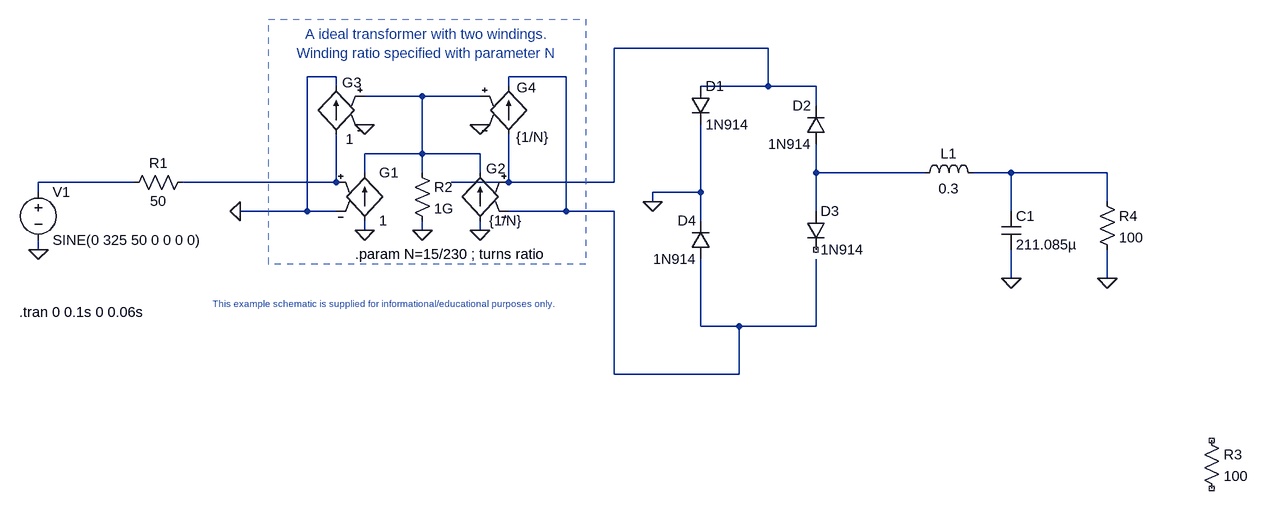
[diagram p0: schematic LC_filter2_withRectifier.asc]
LC_filter2_withRectifier.asc, the LTspice schematic file:
Version 4
SHEET 1 1204 680
WIRE -6096 -2176 -6352 -2176
WIRE -6816 -2128 -6864 -2128
WIRE -6432 -2128 -6528 -2128
WIRE -6816 -2112 -6816 -2128
WIRE -6528 -2112 -6528 -2128
WIRE -6096 -2112 -6096 -2176
WIRE -6096 -2112 -6208 -2112
WIRE -6016 -2112 -6096 -2112
WIRE -6672 -2096 -6768 -2096
WIRE -6576 -2096 -6672 -2096
WIRE -6016 -2080 -6016 -2112
WIRE -6672 -2000 -6672 -2096
WIRE -6672 -2000 -6768 -2000
WIRE -6576 -2000 -6672 -2000
WIRE -6768 -1968 -6768 -2000
WIRE -6672 -1968 -6672 -2000
WIRE -6576 -1968 -6576 -2000
WIRE -6016 -1968 -6016 -2016
WIRE -5616 -1968 -6016 -1968
WIRE -5472 -1968 -5536 -1968
WIRE -5312 -1968 -5472 -1968
WIRE -7152 -1952 -7312 -1952
WIRE -6816 -1952 -6816 -2032
WIRE -6816 -1952 -7072 -1952
WIRE -6528 -1952 -6528 -2032
WIRE -6528 -1952 -6624 -1952
WIRE -6352 -1952 -6352 -2176
WIRE -6352 -1952 -6528 -1952
WIRE -7312 -1936 -7312 -1952
WIRE -6208 -1936 -6208 -2048
WIRE -6208 -1936 -6288 -1936
WIRE -6288 -1920 -6288 -1936
WIRE -5312 -1920 -5312 -1968
WIRE -6864 -1904 -6864 -2128
WIRE -6864 -1904 -6976 -1904
WIRE -6816 -1904 -6864 -1904
WIRE -6432 -1904 -6432 -2128
WIRE -6432 -1904 -6528 -1904
WIRE -6352 -1904 -6432 -1904
WIRE -6016 -1904 -6016 -1968
WIRE -5472 -1904 -5472 -1968
WIRE -6208 -1888 -6208 -1936
WIRE -6768 -1872 -6768 -1888
WIRE -6672 -1872 -6672 -1888
WIRE -6576 -1872 -6576 -1888
WIRE -7312 -1840 -7312 -1856
WIRE -5472 -1792 -5472 -1840
WIRE -5312 -1792 -5312 -1840
WIRE -6208 -1712 -6208 -1824
WIRE -6144 -1712 -6208 -1712
WIRE -6016 -1712 -6016 -1824
WIRE -6016 -1712 -6144 -1712
WIRE -6352 -1632 -6352 -1904
WIRE -6144 -1632 -6144 -1712
WIRE -6144 -1632 -6352 -1632
FLAG -7312 -1840 0
FLAG -6576 -1872 0
FLAG -6768 -1872 0
FLAG -6768 -2048 0
FLAG -6576 -2048 0
FLAG -6672 -1872 0
FLAG -6976 -1904 0
FLAG -6288 -1920 0
FLAG -5472 -1792 0
FLAG -5312 -1792 0
SYMBOL voltage -7312 -1952 R0
WINDOW 123 0 0 Left 0
WINDOW 39 0 0 Left 0
SYMATTR InstName V1
SYMATTR Value SINE(0 325 50 0 0 0 0)
SYMBOL res -7056 -1968 R90
WINDOW 0 0 56 VBottom 2
WINDOW 3 32 56 VTop 2
SYMATTR InstName R1
SYMATTR Value 50
SYMBOL g -6768 -1984 R0
SYMATTR InstName G1
SYMATTR Value 1
SYMBOL g -6576 -1984 M0
WINDOW 0 -10 9 Right 2
WINDOW 3 -15 96 Right 2
SYMATTR InstName G2
SYMATTR Value {1/N}
SYMBOL g -6816 -2128 M0
WINDOW 0 -10 10 Right 2
WINDOW 3 -16 104 Right 2
SYMATTR InstName G3
SYMATTR Value 1
SYMBOL g -6528 -2128 R0
WINDOW 0 13 18 Left 2
WINDOW 3 12 101 Left 2
SYMATTR InstName G4
SYMATTR Value {1/N}
SYMBOL res -6688 -1984 R0
SYMATTR InstName R2
SYMATTR Value 1G
SYMBOL diode -6224 -2112 R0
SYMATTR InstName D1
SYMATTR Value 1N914
SYMBOL diode -6000 -2016 R180
WINDOW 0 24 64 Left 2
WINDOW 3 24 0 Left 2
SYMATTR InstName D2
SYMATTR Value 1N914
SYMBOL diode -6032 -1904 R0
SYMATTR InstName D3
SYMATTR Value 1N914
SYMBOL diode -6192 -1824 R180
WINDOW 0 24 64 Left 2
WINDOW 3 24 0 Left 2
SYMATTR InstName D4
SYMATTR Value 1N914
SYMBOL cap -5488 -1904 R0
SYMATTR InstName C1
SYMATTR Value 211.085µ
SYMBOL res 1120 272 R0
SYMATTR InstName R3
SYMATTR Value 100
SYMBOL res -5328 -1936 R0
SYMATTR InstName R4
SYMATTR Value 100
SYMBOL ind -5632 -1952 R270
WINDOW 0 32 56 VTop 2
WINDOW 3 5 56 VBottom 2
SYMATTR InstName L1
SYMATTR Value 0.3
TEXT -6736 -1760 Top 1 ;This example schematic is supplied for informational/educational purposes only.
TEXT -6664 -2152 Bottom 2 ;A ideal transformer with two windings.\nWinding ratio specified with parameter N
TEXT -6784 -1832 Left 2 !.param N=15/230 ; turns ratio
TEXT -7344 -1736 Left 2 !.tran 0 0.1s 0 0.06s
RECTANGLE Normal -6400 -1816 -6928 -2224 2

The netlist it stands for:
* LC_filter2_withRectifier.asc
V1 N006 0 SINE(0 325 50 0 0 0 0)
R1 N007 N006 50
G1 0 N003 N007 0 1
G2 0 N003 N001 N002 {1/N}
G3 N007 0 N003 0 1
G4 N001 N002 N003 0 {1/N}
R2 N003 0 1G
D1 N001 0 1N914
D2 N004 N001 1N914
D3 N004 NC_01 1N914
D4 N002 0 1N914
C1 N005 0 211.085µ
R3 NC_02 NC_03 100
R4 N005 0 100
L1 N004 N005 0.3
.model D D
.lib standard.dio
* This example schematic is supplied for informational/educational purposes only.
* A ideal transformer with two windings.
* Winding ratio specified with parameter N
.param N=15/230 ; turns ratio
.tran 0 0.1s 0 0.06s
.backanno
.end